# Altium project flower_lamp.PrjPcb
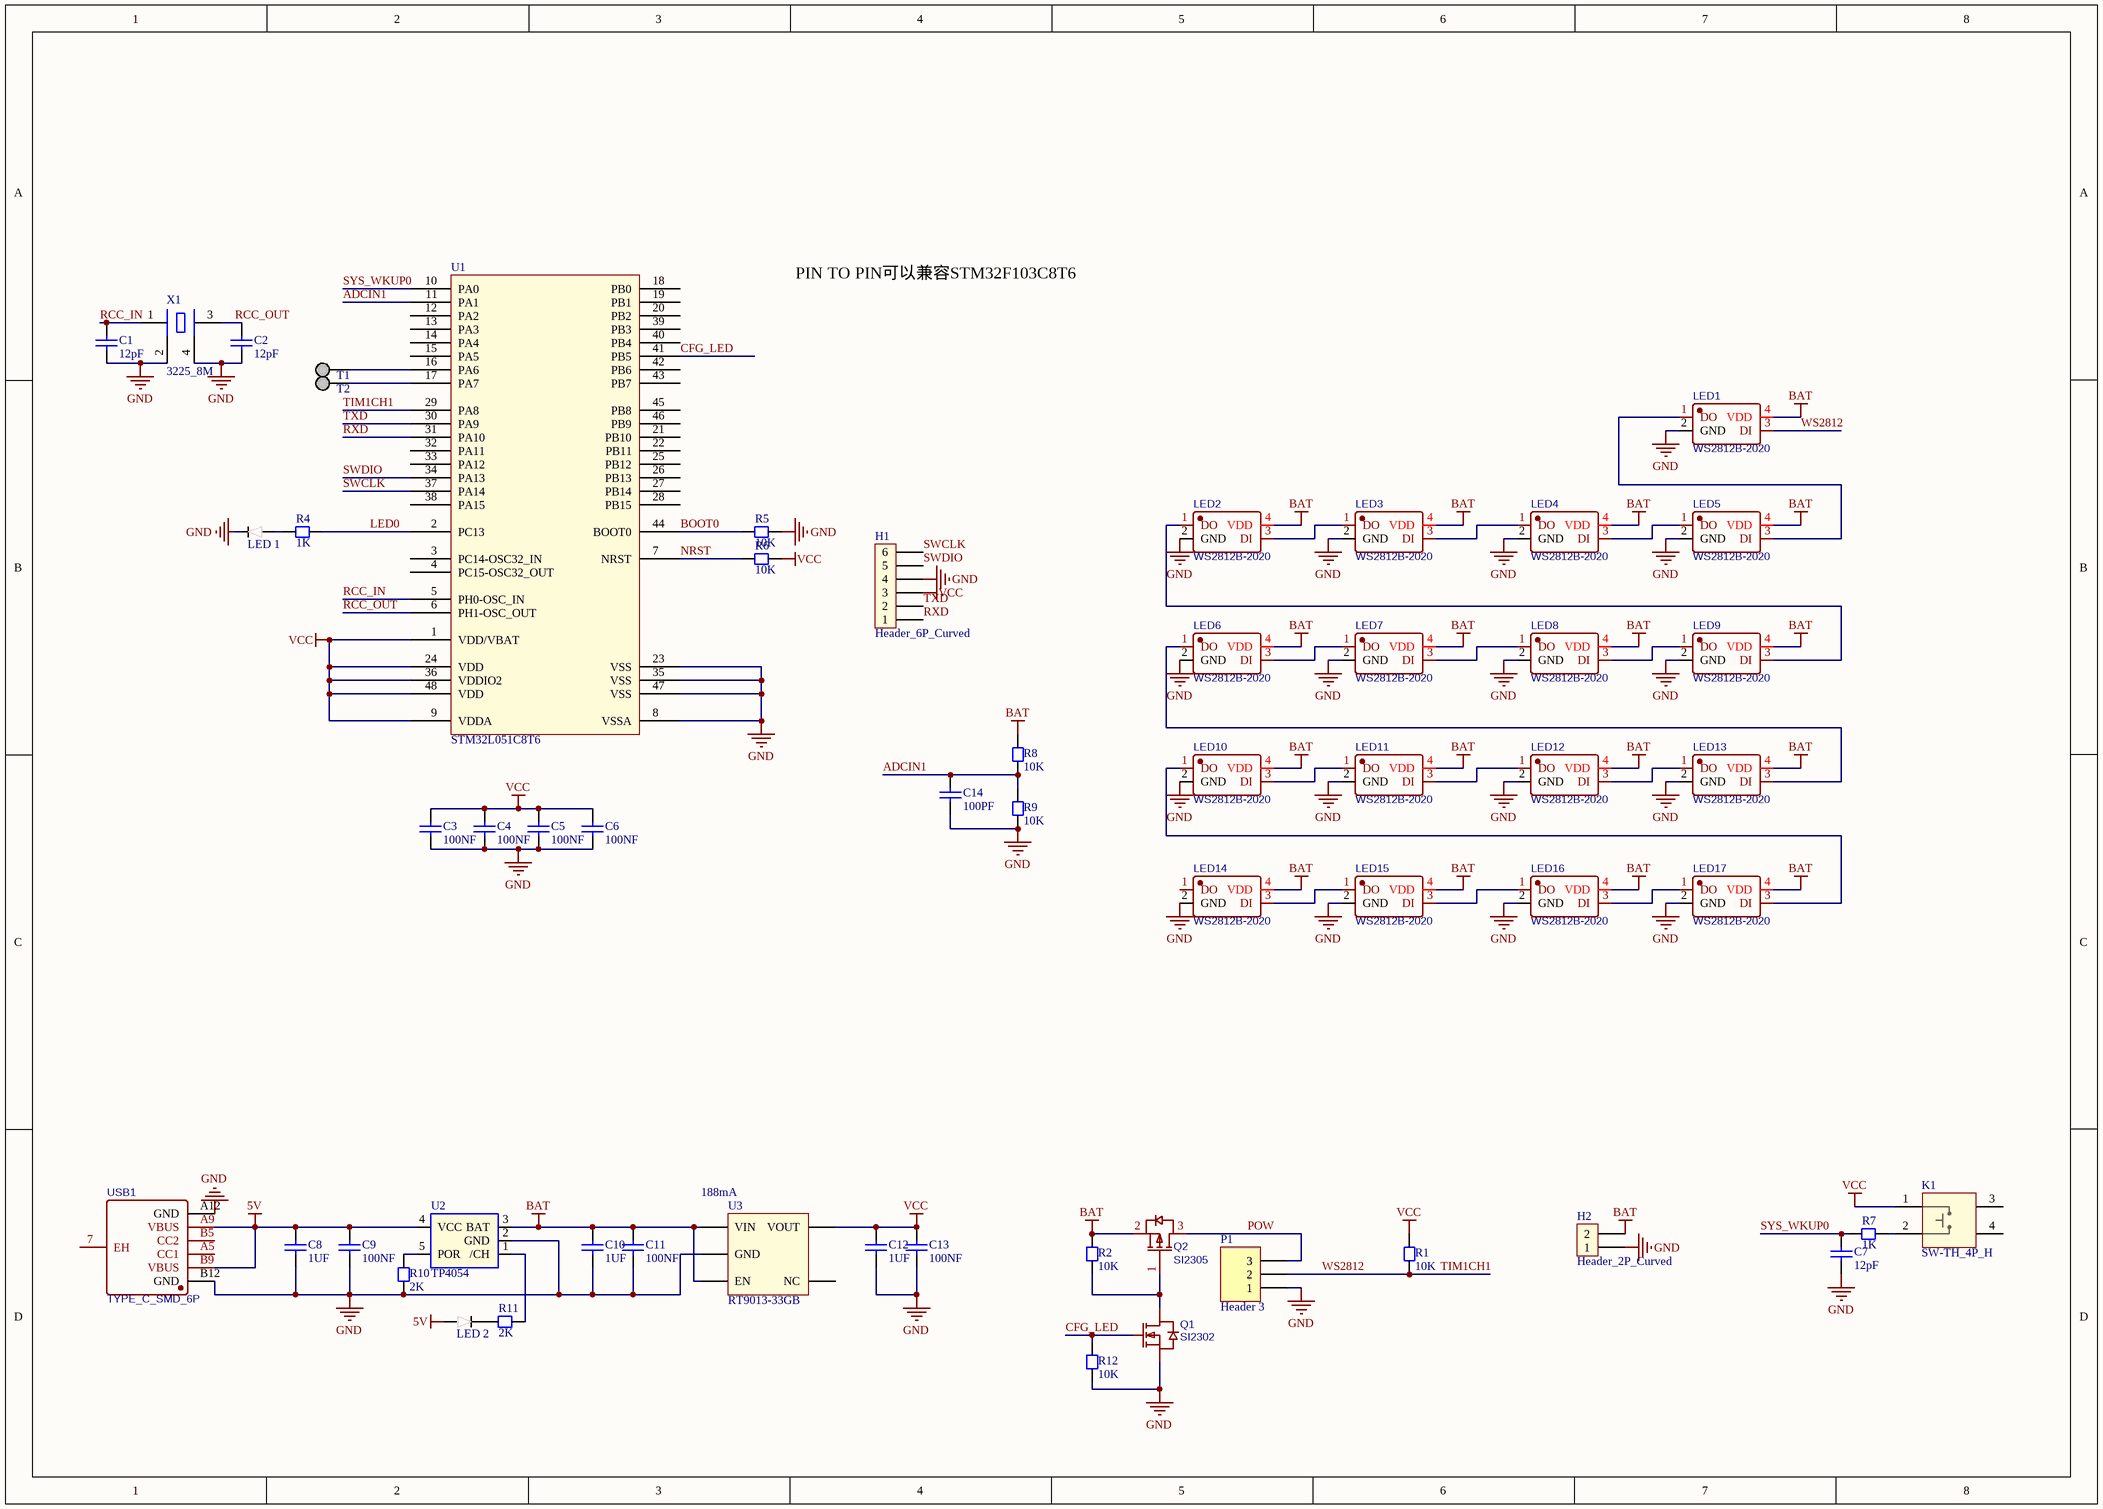
[diagram p0: Sheet1.SchDoc]
1 sheet, 57 parts. Net scope: global (net labels, ports and power ports of the same name join across sheets).
Board file: PCB.PcbDoc

## Sheet Sheet1.SchDoc
size A3; SheetNumber: 1; SheetTotal: 1

### Parts
C1  12pF  [CC1608-0603]
C2  12pF  [CC1608-0603]
C3  100NF  [CC1608-0603]
C4  100NF  [CC1608-0603]
C5  100NF  [CC1608-0603]
C6  100NF  [CC1608-0603]
C7  12pF  [CC1608-0603]
C8  1UF  [CC1608-0603]
C9  100NF  [CC1608-0603]
C10  1UF  [CC1608-0603]
C11  100NF  [CC1608-0603]
C12  1UF  [CC1608-0603]
C13  100NF  [CC1608-0603]
C14  100PF  [CC1608-0603]
H1  Header_6P_Curved  [Header_2_54_6PW]
H2  Header_2P_Curved  [Header_2_54_2PW]
K1  SW-TH_4P_H  [SW-TH_KH-6X6X7H-ZJ]
LED1  WS2812B-2020  [WS2812B-2020]
LED2  WS2812B-2020  [WS2812B-2020]
LED3  WS2812B-2020  [WS2812B-2020]
LED4  WS2812B-2020  [WS2812B-2020]
LED5  WS2812B-2020  [WS2812B-2020]
LED6  WS2812B-2020  [WS2812B-2020]
LED7  WS2812B-2020  [WS2812B-2020]
LED8  WS2812B-2020  [WS2812B-2020]
LED9  WS2812B-2020  [WS2812B-2020]
LED10  WS2812B-2020  [WS2812B-2020]
LED11  WS2812B-2020  [WS2812B-2020]
LED12  WS2812B-2020  [WS2812B-2020]
LED13  WS2812B-2020  [WS2812B-2020]
LED14  WS2812B-2020  [WS2812B-2020]
LED15  WS2812B-2020  [WS2812B-2020]
LED16  WS2812B-2020  [WS2812B-2020]
LED17  WS2812B-2020  [WS2812B-2020]
LED_1  LED 0603  [LED 0603]  (value not drawn)
LED_2  LED 0603  [LED 0603]  (value not drawn)
P1  Header 3  [HDR1X3]
Q1  SI2302  [SOT-23]
Q2  SI2305  [SOT-23]
R1  10K  [CR1608-0603]
R2  10K  [CR1608-0603]
R4  1K  [CR1608-0603]
R5  10K  [CR1608-0603]
R6  10K  [CR1608-0603]
R7  1K  [CR1608-0603]
R8  10K  [CR1608-0603]
R9  10K  [CR1608-0603]
R10  2K  [CR1608-0603]
R11  2K  [CR1608-0603]
R12  10K  [CR1608-0603]
T1  test  [test]  (value not drawn)
T2  test  [test]  (value not drawn)
U1  STM32L051C8T6  [LQFP-48]
U2  TP4054  [SOT23-5]
U3  RT9013-33GB  [SOT23-5]
USB1  TYPE_C_SMD_6P  [TYPE-C-SMD_TYPE-C-6P]
X1  3225_8M  [XTAL-3225]

### Nets
5V: C8.2 C9.2 LED_2.1 U2.4(VCC) USB1.A9(VBUS) USB1.B9(VBUS)
BAT: C10.2 C11.2 H2.2 LED1.4(VDD) LED2.4(VDD) LED3.4(VDD) LED4.4(VDD) LED5.4(VDD) LED6.4(VDD) LED7.4(VDD) LED8.4(VDD) LED9.4(VDD) LED10.4(VDD) LED11.4(VDD) LED12.4(VDD) LED13.4(VDD) LED14.4(VDD) LED15.4(VDD) LED16.4(VDD) LED17.4(VDD) Q2.2(S) R2.1 R8.2 U2.3(BAT) U3.1(VIN) U3.3(EN)
GND: C1.1 C2.1 C3.1 C4.1 C5.1 C6.1 C7.1 C8.1 C9.1 C10.1 C11.1 C12.1 C13.1 C14.1 H1.4 H2.1 LED1.2(GND) LED2.2(GND) LED3.2(GND) LED4.2(GND) LED5.2(GND) LED6.2(GND) LED7.2(GND) LED8.2(GND) LED9.2(GND) LED10.2(GND) LED11.2(GND) LED12.2(GND) LED13.2(GND) LED14.2(GND) LED15.2(GND) LED16.2(GND) LED17.2(GND) LED_1.2 P1.1 Q1.2(S) R5.1 R9.1 R10.1 R12.2 U1.8(VSSA) U1.23(VSS) U1.35(VSS) U1.47(VSS) U2.2(GND) U3.2(GND) USB1.A12(GND) USB1.B12(GND) X1.2(GND) X1.4(GND)
VCC: C3.2 C4.2 C5.2 C6.2 C12.2 C13.2 H1.3 K1.1 R1.1 R6.1 U1.1(VDD/VBAT) U1.9(VDDA) U1.24(VDD) U1.36(VDDIO2) U1.48(VDD) U3.5(VOUT)
ADCIN1: C14.2 R8.1 R9.2 U1.11(PA1)
BOOT0: R5.2 U1.44(BOOT0)
CFG_LED: Q1.1(G) R12.1 U1.41(PB5)
LED0: R4.2 U1.2(PC13)
NRST: R6.2 U1.7(NRST)
POW: P1.3 Q2.3(D)
RCC_IN: C1.2 U1.5(PH0-OSC_IN) X1.1(OSC1)
RCC_OUT: C2.2 U1.6(PH1-OSC_OUT) X1.3(OSC2)
RXD: H1.1 U1.31(PA10)
SWCLK: H1.6 U1.37(PA14)
SWDIO: H1.5 U1.34(PA13)
SYS_WKUP0: C7.2 R7.1 U1.10(PA0)
TIM1CH1: LED1.3(DI) P1.2 R1.2 U1.29(PA8)  [also labelled WS2812]
TXD: H1.2 U1.30(PA9)
NetK1_2: K1.2 R7.2
NetLED1_1: LED1.1(DO) LED5.3(DI)
NetLED2_1: LED2.1(DO) LED9.3(DI)
NetLED2_3: LED2.3(DI) LED3.1(DO)
NetLED3_3: LED3.3(DI) LED4.1(DO)
NetLED4_3: LED4.3(DI) LED5.1(DO)
NetLED6_1: LED6.1(DO) LED13.3(DI)
NetLED6_3: LED6.3(DI) LED7.1(DO)
NetLED7_3: LED7.3(DI) LED8.1(DO)
NetLED8_3: LED8.3(DI) LED9.1(DO)
NetLED10_1: LED10.1(DO) LED17.3(DI)
NetLED10_3: LED10.3(DI) LED11.1(DO)
NetLED11_3: LED11.3(DI) LED12.1(DO)
NetLED12_3: LED12.3(DI) LED13.1(DO)
NetLED14_3: LED14.3(DI) LED15.1(DO)
NetLED15_3: LED15.3(DI) LED16.1(DO)
NetLED16_3: LED16.3(DI) LED17.1(DO)
NetLED_1_1: LED_1.1 R4.1
NetLED_2_2: LED_2.2 R11.2
NetQ1_3: Q1.3(D) Q2.1(G) R2.2
NetR10_2: R10.2 U2.5(POR)
NetR11_1: R11.1 U2.1(/CH)
NetT1_0: T1.0 U1.16(PA6)
NetT2_0: T2.0 U1.17(PA7)

Not connected (* = marked no-connect by the designer): K1 3 4; LED14 1(DO); U1 3(PC14-OSC32_IN) 4(PC15-OSC32_OUT) 12(PA2) 13(PA3) 14(PA4) 15(PA5) 18(PB0) 19(PB1) 20(PB2) 21(PB10) 22(PB11) 25(PB12) 26(PB13) 27(PB14) 28(PB15) 32(PA11) 33(PA12) 38(PA15) 39(PB3) 40(PB4) 42(PB6) 43(PB7) 45(PB8) 46(PB9); U3 4(NC); USB1 7(EH) A5(CC1) B5(CC2)

### Notes on the sheet
- PIN TO PIN可以兼容STM32F103C8T6
- (near U3) 188mA

### Library data of the parts
C1-C14 = Cap Chip 0603: 0603封装的电容; Published: 8-Jun-2000; Revision: July-2002: Re-released for DXP Platform.; Publisher: Altium Limited
H1 = Header_6P_Curved: 弯的6P排针
H2 = Header_2P_Curved: 弯的2P排针
K1 = SW-TH_4P_H: 卧式轻触开关
LED1-LED17 = WS2812B-2020: Manufacturer: worldsemi; Contributor: LCSC; Supplier: LCSC; Supplier Part: C965555; Manufacturer Part: WS2812B-2020; JLCPCB Part Class: Extended Part; spicePre: L; spiceSymbolName: WS2812B-2020
P1 = Header 3: Header, 3-Pin; LatestRevisionDate: 17-Jul-2002; LatestRevisionNote: Re-released for DXP Platform.; Publisher: Altium Limited
Q1 = SI2302: N沟道 / 漏源电压(Vdss) 20V / 连续漏极电流(Id) 2.8A / 功率(Pd) 900mW / 导通电阻(RDS(on)@Vgs,Id) 55mΩ@4.5V,2.8A / 阈值电压(Vgs(th)@Id) 1.2V@250uA / 输入电容(Ciss@Vds) 260pF@10V; Manufacturer: TWGMC(台湾迪嘉); Manufacturer Part: SI2306; Contributor: LCSC; Supplier: LCSC; Supplier Part: C727154; JLCPCB Part Class: Extended Part; spicePre: Q; spiceSymbolName: SI2306_C727154
Q2 = SI2305: SOT-23 2.8A MOS管P沟道场效应管晶体管; Manufacturer: UMW(友台半导体); Manufacturer Part: SI2305A; Contributor: LCSC; Supplier: LCSC; Supplier Part: C347488; JLCPCB Part Class: Extended Part; spicePre: Q; spiceSymbolName: SI2305A
R1 R2 R4-R12 = Resistor Chip 0603: 0603封装电阻; Published: 8-Jun-2000; Revision: July-2002: Re-released for DXP Platform.; Publisher: Altium Limited
T1 T2 = test: 测试点
U1 = STM32L051C8T6: 超低功耗单片机
U2 = TP4054: 迷你充电IC SOT-23-5
U3 = RT9013-33GB: LDO 2.2-5.2V IN 500Ma OUT SOT23-5
USB1 = TYPE_C_SMD_6P: Manufacturer: null; Contributor: LCSC; Supplier: LCSC; Supplier Part: C9900003080; Manufacturer Part: TYPE_C_SMD_6P; JLCPCB Part Class: Extended Part; spicePre: U; spiceSymbolName: TYPE_C_SMD_6P
X1 = XTAL 3225: 3225封装的晶振